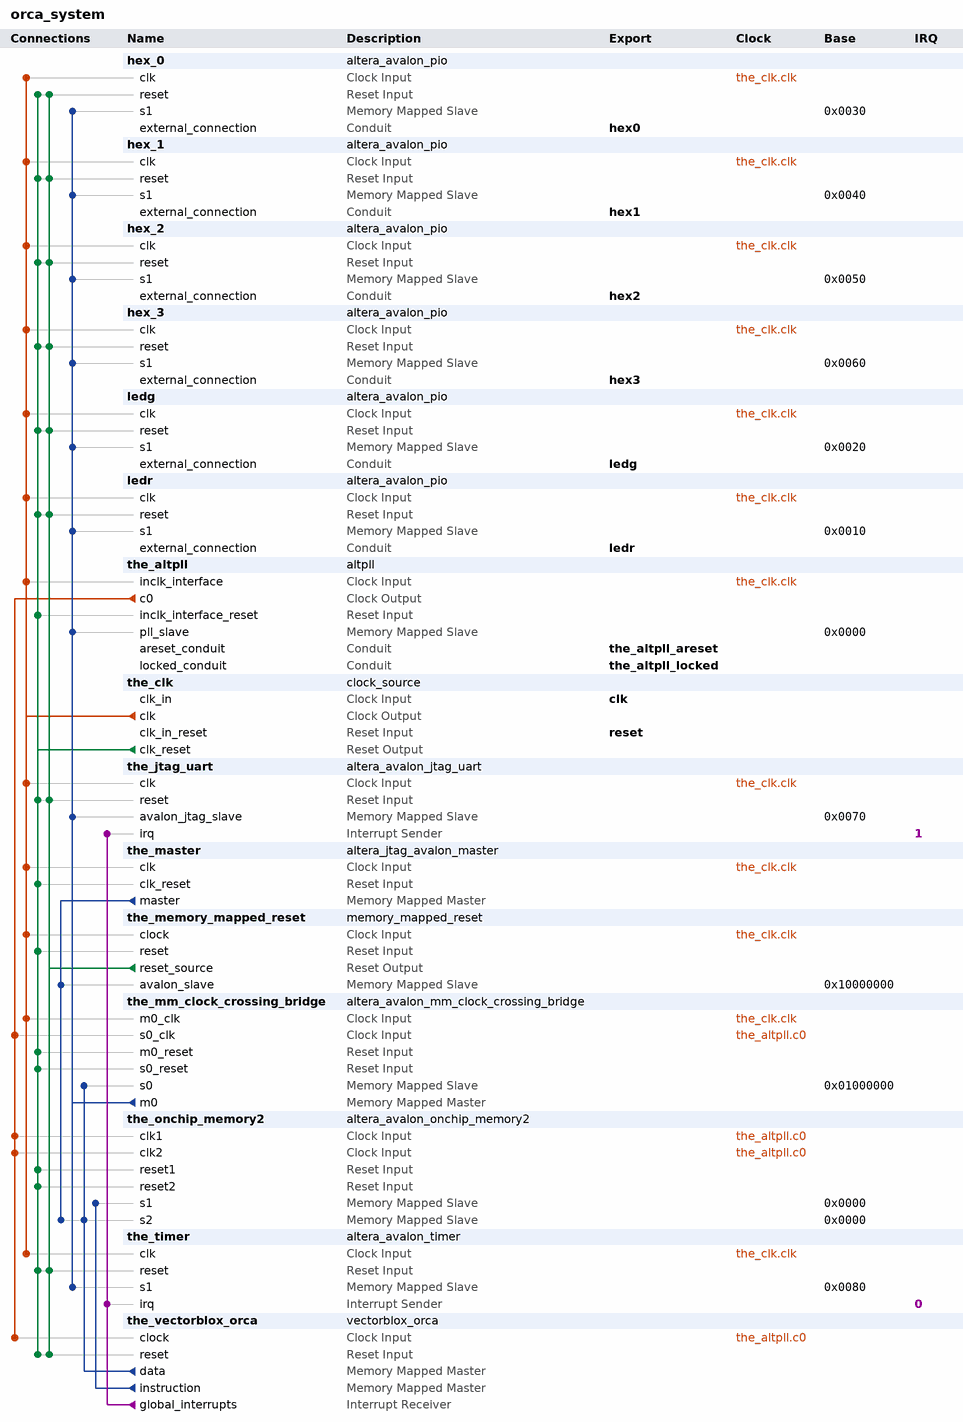
[diagram p0: system contents]
# Platform Designer (Qsys) system orca_system, Cyclone IV E EP4CE115F29C7
# Parameters at their usual value, and those the tool derives, are not listed.
package require -exact qsys 17.1
create_system orca_system
set_project_property DEVICE_FAMILY {Cyclone IV E}
set_project_property DEVICE EP4CE115F29C7

add_instance hex_0 altera_avalon_pio 17.1
set_instance_parameter_value hex_0 direction Output
set_instance_parameter_value hex_0 width 32

add_instance hex_1 altera_avalon_pio 17.1
set_instance_parameter_value hex_1 direction Output
set_instance_parameter_value hex_1 width 32

add_instance hex_2 altera_avalon_pio 17.1
set_instance_parameter_value hex_2 direction Output
set_instance_parameter_value hex_2 width 32

add_instance hex_3 altera_avalon_pio 17.1
set_instance_parameter_value hex_3 direction Output
set_instance_parameter_value hex_3 width 32

add_instance ledg altera_avalon_pio 17.1
set_instance_parameter_value ledg direction Output
set_instance_parameter_value ledg width 32

add_instance ledr altera_avalon_pio 17.1
set_instance_parameter_value ledr direction Output
set_instance_parameter_value ledr width 32

add_instance the_altpll altpll 17.1
set_instance_parameter_value the_altpll CLK0_DIVIDE_BY 1
set_instance_parameter_value the_altpll CLK0_MULTIPLY_BY 2
set_instance_parameter_value the_altpll INCLK0_INPUT_FREQUENCY 20000
set_instance_parameter_value the_altpll PORT_ARESET PORT_USED
set_instance_parameter_value the_altpll PORT_LOCKED PORT_USED
set_instance_parameter_value the_altpll PORT_clk1 PORT_UNUSED
set_instance_parameter_value the_altpll PORT_clk2 PORT_UNUSED
set_instance_parameter_value the_altpll PORT_clk3 PORT_UNUSED

add_instance the_clk clock_source 17.1
set_instance_parameter_value the_clk clockFrequency 50000000

add_instance the_jtag_uart altera_avalon_jtag_uart 17.1
set_instance_parameter_value the_jtag_uart simInteractiveOptions NO_INTERACTIVE_WINDOWS

add_instance the_master altera_jtag_avalon_master 17.1

add_instance the_memory_mapped_reset memory_mapped_reset 1.0
set_instance_parameter_value the_memory_mapped_reset ADDR_WIDTH 2
set_instance_parameter_value the_memory_mapped_reset REGISTER_SIZE 32

add_instance the_mm_clock_crossing_bridge altera_avalon_mm_clock_crossing_bridge 17.1
set_instance_parameter_value the_mm_clock_crossing_bridge ADDRESS_WIDTH 10
set_instance_parameter_value the_mm_clock_crossing_bridge COMMAND_FIFO_DEPTH 4
set_instance_parameter_value the_mm_clock_crossing_bridge DATA_WIDTH 32
set_instance_parameter_value the_mm_clock_crossing_bridge MASTER_SYNC_DEPTH 2
set_instance_parameter_value the_mm_clock_crossing_bridge MAX_BURST_SIZE 1
set_instance_parameter_value the_mm_clock_crossing_bridge RESPONSE_FIFO_DEPTH 4
set_instance_parameter_value the_mm_clock_crossing_bridge SLAVE_SYNC_DEPTH 2
set_instance_parameter_value the_mm_clock_crossing_bridge USE_AUTO_ADDRESS_WIDTH 1

add_instance the_onchip_memory2 altera_avalon_onchip_memory2 17.1
set_instance_parameter_value the_onchip_memory2 dataWidth 32
set_instance_parameter_value the_onchip_memory2 dualPort true
set_instance_parameter_value the_onchip_memory2 initMemContent true
set_instance_parameter_value the_onchip_memory2 initializationFileName software/test.hex
set_instance_parameter_value the_onchip_memory2 memorySize 65536
set_instance_parameter_value the_onchip_memory2 useNonDefaultInitFile true

add_instance the_timer altera_avalon_timer 17.1
set_instance_parameter_value the_timer period 1
set_instance_parameter_value the_timer periodUnits MSEC

add_instance the_vectorblox_orca vectorblox_orca 1.0
set_instance_parameter_value the_vectorblox_orca AMR0_ADDR_BASE 0
set_instance_parameter_value the_vectorblox_orca AMR0_ADDR_LAST 0
set_instance_parameter_value the_vectorblox_orca AUX_MEMORY_REGIONS 1
set_instance_parameter_value the_vectorblox_orca AXI_ID_WIDTH 2
set_instance_parameter_value the_vectorblox_orca BTB_ENTRIES 16
set_instance_parameter_value the_vectorblox_orca DATA_REQUEST_REGISTER 0
set_instance_parameter_value the_vectorblox_orca DATA_RETURN_REGISTER 0
set_instance_parameter_value the_vectorblox_orca DAUX_REQUEST_REGISTER 2
set_instance_parameter_value the_vectorblox_orca DAUX_RETURN_REGISTER 1
set_instance_parameter_value the_vectorblox_orca DCACHE_EXTERNAL_WIDTH 32
set_instance_parameter_value the_vectorblox_orca DCACHE_LINE_SIZE 32
set_instance_parameter_value the_vectorblox_orca DCACHE_SIZE 0
set_instance_parameter_value the_vectorblox_orca DCACHE_WRITEBACK 0
set_instance_parameter_value the_vectorblox_orca DC_REQUEST_REGISTER 1
set_instance_parameter_value the_vectorblox_orca DC_RETURN_REGISTER 0
set_instance_parameter_value the_vectorblox_orca DIVIDE_ENABLE 1
set_instance_parameter_value the_vectorblox_orca DUC_REQUEST_REGISTER 2
set_instance_parameter_value the_vectorblox_orca DUC_RETURN_REGISTER 1
set_instance_parameter_value the_vectorblox_orca ENABLE_EXCEPTIONS 1
set_instance_parameter_value the_vectorblox_orca ENABLE_EXT_INTERRUPTS 1
set_instance_parameter_value the_vectorblox_orca FAMILY ALTERA
set_instance_parameter_value the_vectorblox_orca IAUX_REQUEST_REGISTER 1
set_instance_parameter_value the_vectorblox_orca IAUX_RETURN_REGISTER 0
set_instance_parameter_value the_vectorblox_orca ICACHE_EXTERNAL_WIDTH 32
set_instance_parameter_value the_vectorblox_orca ICACHE_LINE_SIZE 32
set_instance_parameter_value the_vectorblox_orca ICACHE_SIZE 0
set_instance_parameter_value the_vectorblox_orca IC_REQUEST_REGISTER 1
set_instance_parameter_value the_vectorblox_orca IC_RETURN_REGISTER 0
set_instance_parameter_value the_vectorblox_orca INSTRUCTION_REQUEST_REGISTER 0
set_instance_parameter_value the_vectorblox_orca INSTRUCTION_RETURN_REGISTER 0
set_instance_parameter_value the_vectorblox_orca INTERRUPT_VECTOR 512
set_instance_parameter_value the_vectorblox_orca IUC_REQUEST_REGISTER 1
set_instance_parameter_value the_vectorblox_orca IUC_RETURN_REGISTER 0
set_instance_parameter_value the_vectorblox_orca LOG2_BURSTLENGTH 4
set_instance_parameter_value the_vectorblox_orca MAX_IFETCHES_IN_FLIGHT 4
set_instance_parameter_value the_vectorblox_orca MTIME_ENABLE 1
set_instance_parameter_value the_vectorblox_orca MULTIPLY_ENABLE 1
set_instance_parameter_value the_vectorblox_orca NUM_EXT_INTERRUPTS 2
set_instance_parameter_value the_vectorblox_orca PIPELINE_STAGES 5
set_instance_parameter_value the_vectorblox_orca POWER_OPTIMIZED 0
set_instance_parameter_value the_vectorblox_orca REGISTER_SIZE 32
set_instance_parameter_value the_vectorblox_orca RESET_VECTOR 0
set_instance_parameter_value the_vectorblox_orca SHIFTER_MAX_CYCLES 1
set_instance_parameter_value the_vectorblox_orca UC_MEMORY_REGIONS 0
set_instance_parameter_value the_vectorblox_orca UMR0_ADDR_BASE 0
set_instance_parameter_value the_vectorblox_orca UMR0_ADDR_LAST 0
set_instance_parameter_value the_vectorblox_orca VCP_ENABLE 0

# connections
add_connection the_altpll.c0 the_mm_clock_crossing_bridge.s0_clk clock
add_connection the_altpll.c0 the_onchip_memory2.clk1 clock
add_connection the_altpll.c0 the_onchip_memory2.clk2 clock
add_connection the_altpll.c0 the_vectorblox_orca.clock clock
add_connection the_clk.clk hex_0.clk clock
add_connection the_clk.clk hex_1.clk clock
add_connection the_clk.clk hex_2.clk clock
add_connection the_clk.clk hex_3.clk clock
add_connection the_clk.clk ledg.clk clock
add_connection the_clk.clk ledr.clk clock
add_connection the_clk.clk the_altpll.inclk_interface clock
add_connection the_clk.clk the_jtag_uart.clk clock
add_connection the_clk.clk the_master.clk clock
add_connection the_clk.clk the_memory_mapped_reset.clock clock
add_connection the_clk.clk the_mm_clock_crossing_bridge.m0_clk clock
add_connection the_clk.clk the_timer.clk clock
add_connection the_clk.clk_reset hex_0.reset reset
add_connection the_clk.clk_reset hex_1.reset reset
add_connection the_clk.clk_reset hex_2.reset reset
add_connection the_clk.clk_reset hex_3.reset reset
add_connection the_clk.clk_reset ledg.reset reset
add_connection the_clk.clk_reset ledr.reset reset
add_connection the_clk.clk_reset the_altpll.inclk_interface_reset reset
add_connection the_clk.clk_reset the_jtag_uart.reset reset
add_connection the_clk.clk_reset the_master.clk_reset reset
add_connection the_clk.clk_reset the_memory_mapped_reset.reset reset
add_connection the_clk.clk_reset the_mm_clock_crossing_bridge.m0_reset reset
add_connection the_clk.clk_reset the_mm_clock_crossing_bridge.s0_reset reset
add_connection the_clk.clk_reset the_onchip_memory2.reset1 reset
add_connection the_clk.clk_reset the_onchip_memory2.reset2 reset
add_connection the_clk.clk_reset the_timer.reset reset
add_connection the_clk.clk_reset the_vectorblox_orca.reset reset
add_connection the_memory_mapped_reset.reset_source hex_0.reset reset
add_connection the_memory_mapped_reset.reset_source hex_1.reset reset
add_connection the_memory_mapped_reset.reset_source hex_2.reset reset
add_connection the_memory_mapped_reset.reset_source hex_3.reset reset
add_connection the_memory_mapped_reset.reset_source ledg.reset reset
add_connection the_memory_mapped_reset.reset_source ledr.reset reset
add_connection the_memory_mapped_reset.reset_source the_jtag_uart.reset reset
add_connection the_memory_mapped_reset.reset_source the_timer.reset reset
add_connection the_memory_mapped_reset.reset_source the_vectorblox_orca.reset reset
add_connection the_master.master the_memory_mapped_reset.avalon_slave avalon
set_connection_parameter_value the_master.master/the_memory_mapped_reset.avalon_slave baseAddress 0x10000000
add_connection the_master.master the_onchip_memory2.s2 avalon
set_connection_parameter_value the_master.master/the_onchip_memory2.s2 baseAddress 0x0000
add_connection the_mm_clock_crossing_bridge.m0 hex_0.s1 avalon
set_connection_parameter_value the_mm_clock_crossing_bridge.m0/hex_0.s1 baseAddress 0x0030
add_connection the_mm_clock_crossing_bridge.m0 hex_1.s1 avalon
set_connection_parameter_value the_mm_clock_crossing_bridge.m0/hex_1.s1 baseAddress 0x0040
add_connection the_mm_clock_crossing_bridge.m0 hex_2.s1 avalon
set_connection_parameter_value the_mm_clock_crossing_bridge.m0/hex_2.s1 baseAddress 0x0050
add_connection the_mm_clock_crossing_bridge.m0 hex_3.s1 avalon
set_connection_parameter_value the_mm_clock_crossing_bridge.m0/hex_3.s1 baseAddress 0x0060
add_connection the_mm_clock_crossing_bridge.m0 ledg.s1 avalon
set_connection_parameter_value the_mm_clock_crossing_bridge.m0/ledg.s1 baseAddress 0x0020
add_connection the_mm_clock_crossing_bridge.m0 ledr.s1 avalon
set_connection_parameter_value the_mm_clock_crossing_bridge.m0/ledr.s1 baseAddress 0x0010
add_connection the_mm_clock_crossing_bridge.m0 the_altpll.pll_slave avalon
set_connection_parameter_value the_mm_clock_crossing_bridge.m0/the_altpll.pll_slave baseAddress 0x0000
add_connection the_mm_clock_crossing_bridge.m0 the_jtag_uart.avalon_jtag_slave avalon
set_connection_parameter_value the_mm_clock_crossing_bridge.m0/the_jtag_uart.avalon_jtag_slave baseAddress 0x0070
add_connection the_mm_clock_crossing_bridge.m0 the_timer.s1 avalon
set_connection_parameter_value the_mm_clock_crossing_bridge.m0/the_timer.s1 baseAddress 0x0080
add_connection the_vectorblox_orca.data the_mm_clock_crossing_bridge.s0 avalon
set_connection_parameter_value the_vectorblox_orca.data/the_mm_clock_crossing_bridge.s0 baseAddress 0x01000000
add_connection the_vectorblox_orca.data the_onchip_memory2.s2 avalon
set_connection_parameter_value the_vectorblox_orca.data/the_onchip_memory2.s2 baseAddress 0x0000
add_connection the_vectorblox_orca.instruction the_onchip_memory2.s1 avalon
set_connection_parameter_value the_vectorblox_orca.instruction/the_onchip_memory2.s1 baseAddress 0x0000
add_connection the_vectorblox_orca.global_interrupts the_jtag_uart.irq interrupt
set_connection_parameter_value the_vectorblox_orca.global_interrupts/the_jtag_uart.irq irqNumber 1
add_connection the_vectorblox_orca.global_interrupts the_timer.irq interrupt
set_connection_parameter_value the_vectorblox_orca.global_interrupts/the_timer.irq irqNumber 0

# exported interfaces
add_interface clk clock sink
set_interface_property clk EXPORT_OF the_clk.clk_in
add_interface hex0 conduit end
set_interface_property hex0 EXPORT_OF hex_0.external_connection
add_interface hex1 conduit end
set_interface_property hex1 EXPORT_OF hex_1.external_connection
add_interface hex2 conduit end
set_interface_property hex2 EXPORT_OF hex_2.external_connection
add_interface hex3 conduit end
set_interface_property hex3 EXPORT_OF hex_3.external_connection
add_interface ledg conduit end
set_interface_property ledg EXPORT_OF ledg.external_connection
add_interface ledr conduit end
set_interface_property ledr EXPORT_OF ledr.external_connection
add_interface reset reset sink
set_interface_property reset EXPORT_OF the_clk.clk_in_reset
add_interface the_altpll_areset conduit end
set_interface_property the_altpll_areset EXPORT_OF the_altpll.areset_conduit
add_interface the_altpll_locked conduit end
set_interface_property the_altpll_locked EXPORT_OF the_altpll.locked_conduit

set_interconnect_requirement {$system} qsys_mm.clockCrossingAdapter HANDSHAKE
set_interconnect_requirement {$system} qsys_mm.enableEccProtection FALSE
set_interconnect_requirement {$system} qsys_mm.insertDefaultSlave FALSE
set_interconnect_requirement {$system} qsys_mm.maxAdditionalLatency 1

save_system orca_system.qsys
